# Altium schematic sheet PIC.SchDoc
size A4
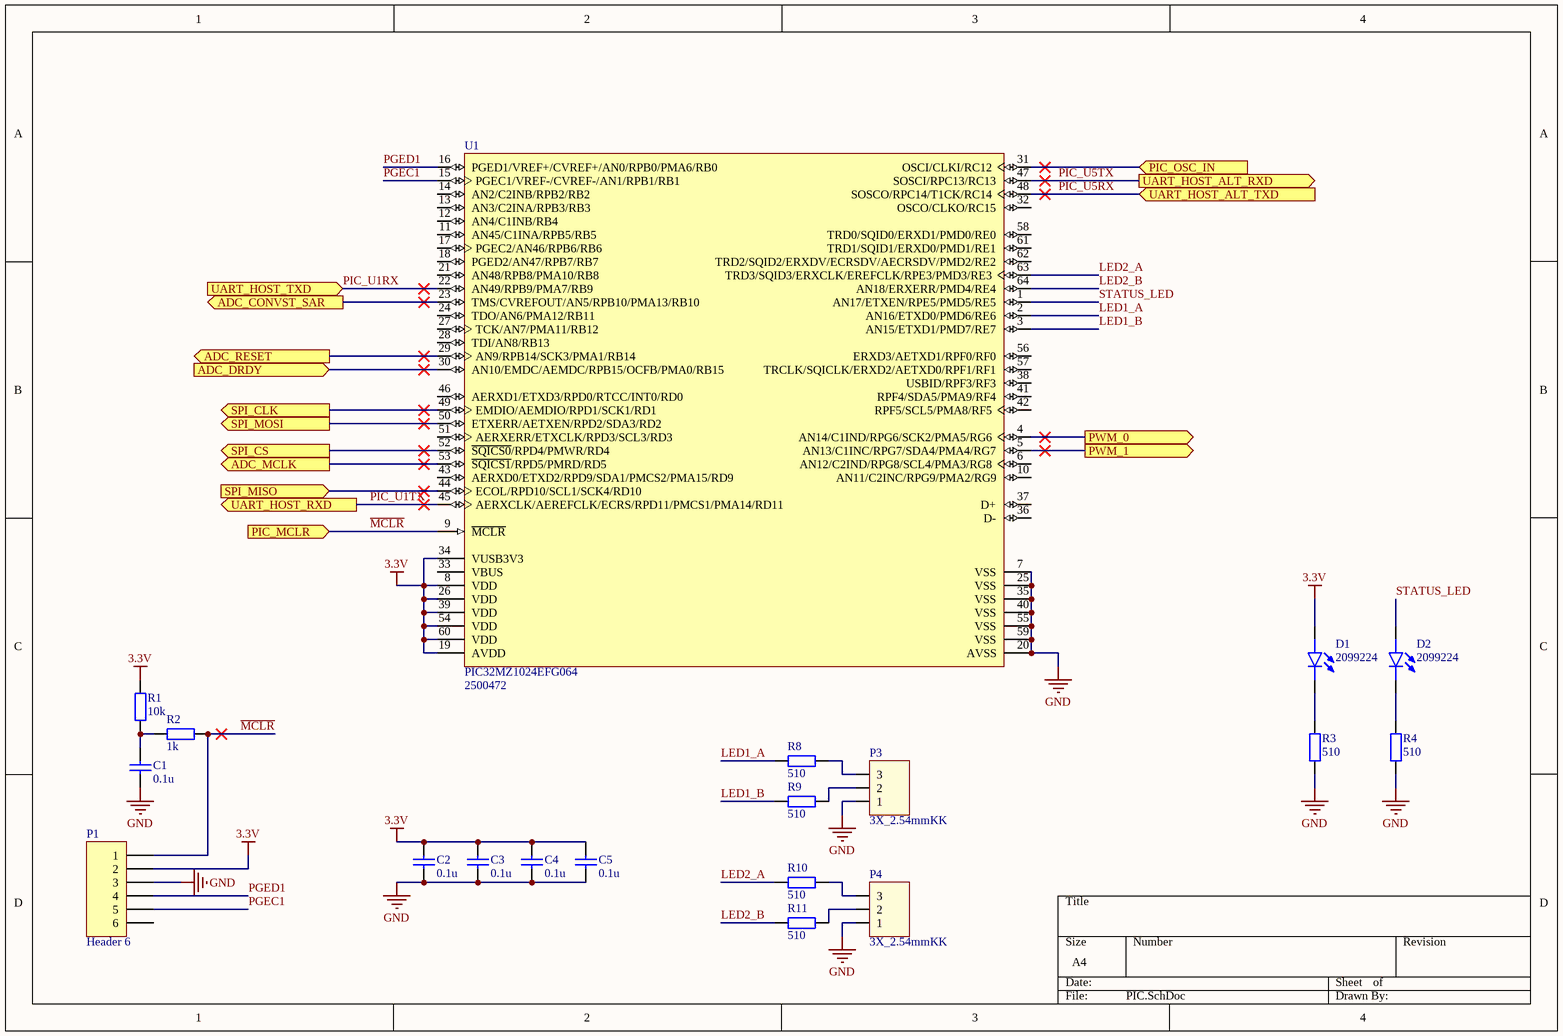
[diagram p0: PIC.SchDoc]

## Parts
C1  0.1u  [CAPC1608M]
C2  0.1u  [CAPC1608M]
C3  0.1u  [CAPC1608M]
C4  0.1u  [CAPC1608M]
C5  0.1u  [CAPC1608M]
D1  Supplier Part Number 1: 2099224  [CD1608-0603]  (hidden comment: KPT-1608SURCK)
D2  Supplier Part Number 1: 2099224  [CD1608-0603]  (hidden comment: KPT-1608SURCK)
P1  Header 6  [HDR1X6]
P3  3X_2.54mmKK  [3X_2.54MM_KK_V]
P4  3X_2.54mmKK  [3X_2.54MM_KK_V]
R1  10k  [RESC1608M]
R2  1k  [RESC1608M]
R3  510  [RESC1608M]
R4  510  [RESC1608M]
R8  510  [RESC1608M]
R9  510  [RESC1608M]
R10  510  [RESC1608M]
R11  510  [RESC1608M]
U1  PIC32MZ1024EFG064  Supplier Part Number 1: 2500472  [MCHP-QFP-PT64_V]

## Ports
ADC_CONVST_SAR (out), ADC_DRDY (in), ADC_MCLK (out), ADC_RESET (out), PIC_MCLR (in), PIC_OSC_IN (in), PWM_0 (out), PWM_1 (out), SPI_CLK (out), SPI_CS (out), SPI_MISO (in), SPI_MOSI (out), UART_HOST_ALT_RXD (out), UART_HOST_ALT_TXD (in), UART_HOST_RXD (out), UART_HOST_TXD (in)

## Nets
3.3V: C2.1 C3.1 C4.1 C5.1 D1.A P1.2 R1.2 U1.8(VDD) U1.19(AVDD) U1.26(VDD) U1.34(VUSB3V3) U1.39(VDD) U1.54(VDD) U1.60(VDD)
GND: C1.2 C2.2 C3.2 C4.2 C5.2 P1.3 P3.1 P4.1 R3.2 R4.2 U1.7(VSS) U1.20(AVSS) U1.25(VSS) U1.35(VSS) U1.40(VSS) U1.55(VSS) U1.59(VSS)
ADC_CONVST_SAR: U1.23(TMS/CVREFOUT/AN5/RPB10/PMA13/RB10) ; port ADC_CONVST_SAR
ADC_DRDY: U1.30(AN10/EMDC/AEMDC/RPB15/OCFB/PMA0/RB15) ; port ADC_DRDY
ADC_MCLK: U1.53(~{SQICS1}/RPD5/PMRD/RD5) ; port ADC_MCLK
ADC_RESET: U1.29(AN9/RPB14/SCK3/PMA1/RB14) ; port ADC_RESET
LED1_A: R8.1 U1.2(AN16/ETXD0/PMD6/RE6)
LED1_B: R9.1 U1.3(AN15/ETXD1/PMD7/RE7)
LED2_A: R10.1 U1.63(TRD3/SQID3/ERXCLK/EREFCLK/RPE3/PMD3/RE3)
LED2_B: R11.1 U1.64(AN18/ERXERR/PMD4/RE4)
~{MCLR}: P1.1 R2.1 U1.9(~{MCLR}) ; port PIC_MCLR
PGEC1: P1.5 U1.15(PGEC1/VREF-/CVREF-/AN1/RPB1/RB1)
PGED1: P1.4 U1.16(PGED1/VREF+/CVREF+/AN0/RPB0/PMA6/RB0)
PIC_OSC_IN: U1.31(OSCI/CLKI/RC12) ; port PIC_OSC_IN
PIC_U1RX: U1.22(AN49/RPB9/PMA7/RB9) ; port UART_HOST_TXD
PIC_U1TX: U1.45(AERXCLK/AEREFCLK/ECRS/RPD11/PMCS1/PMA14/RD11) ; port UART_HOST_RXD
PIC_U5RX: U1.48(SOSCO/RPC14/T1CK/RC14) ; port UART_HOST_ALT_TXD
PIC_U5TX: U1.47(SOSCI/RPC13/RC13) ; port UART_HOST_ALT_RXD
PWM_0: U1.4(AN14/C1IND/RPG6/SCK2/PMA5/RG6) ; port PWM_0
PWM_1: U1.5(AN13/C1INC/RPG7/SDA4/PMA4/RG7) ; port PWM_1
SPI_CLK: U1.49(EMDIO/AEMDIO/RPD1/SCK1/RD1) ; port SPI_CLK
SPI_CS: U1.52(~{SQICS0}/RPD4/PMWR/RD4) ; port SPI_CS
SPI_MISO: U1.44(ECOL/RPD10/SCL1/SCK4/RD10) ; port SPI_MISO
SPI_MOSI: U1.50(ETXERR/AETXEN/RPD2/SDA3/RD2) ; port SPI_MOSI
STATUS_LED: D2.A U1.1(AN17/ETXEN/RPE5/PMD5/RE5)
NetC1_1: C1.1 R1.1 R2.2
NetD1_C: D1.C R3.1
NetD2_C: D2.C R4.1
NetP3_2: P3.2 R9.2
NetP3_3: P3.3 R8.2
NetP4_2: P4.2 R11.2
NetP4_3: P4.3 R10.2

Not connected (* = marked no-connect by the designer): P1 6; U1 6(AN12/C2IND/RPG8/SCL4/PMA3/RG8) 10(AN11/C2INC/RPG9/PMA2/RG9) 11(AN45/C1INA/RPB5/RB5) 12(AN4/C1INB/RB4) 13(AN3/C2INA/RPB3/RB3) 14(AN2/C2INB/RPB2/RB2) 17(PGEC2/AN46/RPB6/RB6) 18(PGED2/AN47/RPB7/RB7) 21(AN48/RPB8/PMA10/RB8) 24(TDO/AN6/PMA12/RB11) 27(TCK/AN7/PMA11/RB12) 28(TDI/AN8/RB13) 32(OSCO/CLKO/RC15) 33(VBUS) 36(D-) 37(D+) 38(USBID/RPF3/RF3) 41(RPF4/SDA5/PMA9/RF4) 42(RPF5/SCL5/PMA8/RF5) 43(AERXD0/ETXD2/RPD9/SDA1/PMCS2/PMA15/RD9) 46(AERXD1/ETXD3/RPD0/RTCC/INT0/RD0) 51(AERXERR/ETXCLK/RPD3/SCL3/RD3) 56(ERXD3/AETXD1/RPF0/RF0) 57(TRCLK/SQICLK/ERXD2/AETXD0/RPF1/RF1) 58(TRD0/SQID0/ERXD1/PMD0/RE0) 61(TRD1/SQID1/ERXD0/PMD1/RE1) 62(TRD2/SQID2/ERXDV/ECRSDV/AECRSDV/PMD2/RE2)

## Library data of the parts
C1-C5 = C: Value: 0.1u
D1 D2 = KPT-1608SURCK: LED, Red, 0603, 20mA; pin to pad: A>1 C>2; Supplier 1: Farnell
P1 = Header 6: Header, 6-Pin; LatestRevisionDate: 17-Jul-2002; LatestRevisionNote: Re-released for DXP Platform.; Publisher: Altium Limited
R1-R4 R8-R11 = R
  R1: Value: 10k
  R2: Value: 1k
  R3 R4 R8-R11: Value: 510
U1 = PIC32MZ1024EFG064: 32-Bit Microcontroller with Audio and Graphics Interfaces, HS USB, Ethernet, and Advanced Analog, 1024 KB Program Memory, 53 I/O Pins, PMP, 64-Pin QFP (PT64); Manufacturer: Microchip; PartNumber: PIC32MZ1024ECG064-E/PT; Packing: Tray; VCC Range: 2.2 to 3.6 V; DatasheetVersion: Rev. B; PackageVersion: C04-085B; PackageReference: QFP-PT64; PackageDescription: 64-Lead Plastic Thin Quad Flatpack, 10 x 10 mm Body, 0.5 mm Pitch; Mounting Technology: Surface Mount; ComponentLink1Description: Manufacturer URL; ComponentLink1URL: http://www.microchip.com/; ComponentLink2Description: Datasheet; ComponentLink2URL: http://ww1.microchip.com/downloads/en/DeviceDoc/60001191B.pdf; ComponentLink3Description: Package Specification; ComponentLink3URL: http://ww1.microchip.com/downloads/en/DeviceDoc/60001191B.pdf; Supplier 1: Farnell